# EAGLE schematic fonte (EAGLE 9.6.2)
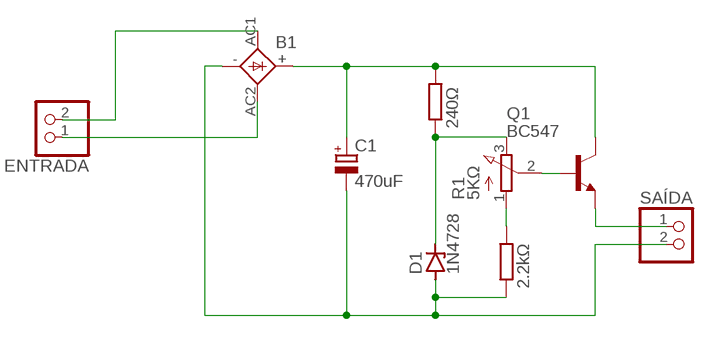
[diagram p0: schematic, sheet 1]

## Parts
B1  1KAB  [1KAB]
C1  470uF  CPOL-EUE5-10.5  [E5-10,5]
D1  1N4728  [DO41Z10]
ENTRADA  PINHD-1X2  [1X02]
Q1  BC547  [TO92]
R1  5KΩ  3RP/1610N  [3RP/1610N]
R2  2.2kΩ  R-EU_0207/10  [0207/10]
R3  240Ω  R-EU_0207/10  [0207/10]
SAÍDA  PINHD-1X2  [1X02]

## Nets
N$1: R1.1(A) R2.2
N$2: D1.C R1.3(E) R3.1
N$3: Q1.2(B) R1.2(S)
N$4: B1.AC1 ENTRADA.2
N$5: B1.AC2 ENTRADA.1
N$6: B1.- C1.- D1.A R2.1 SAÍDA.2
N$7: B1.+ C1.+ Q1.3(C) R3.2
N$9: Q1.1(E) SAÍDA.1

## Library data of the parts
B1 = rectifier:1KAB: RECTIFIER grid 5,08 x 5,08 mm
C1 = rcl:CPOL-EU: POLARIZED CAPACITOR, European symbol; SPICEPREFIX: C
D1 = diode:1N4728: Z DIODE 3.3 V, 1W, 5 percent
ENTRADA SAÍDA = pinhead:PINHD-1X2: PIN HEADER
Q1 = transistor-npn:BC547*: NPN Transistor
R1 = pot:3RP/1610N: 16mm Potentiometer one level Source: http://www.alphapotentiometers.net/html/16mm_pot_2.html
R2 R3 = rcl:R-EU_: RESISTOR, European symbol; SPICEPREFIX: R